# EAGLE design Adafruit 2.13in Tri-Color eInk Display (EAGLE 6.6.0)
COMPANY: ADAFRUIT INDUSTRIES; DRAWN: K. TOWNSEND; REV: A
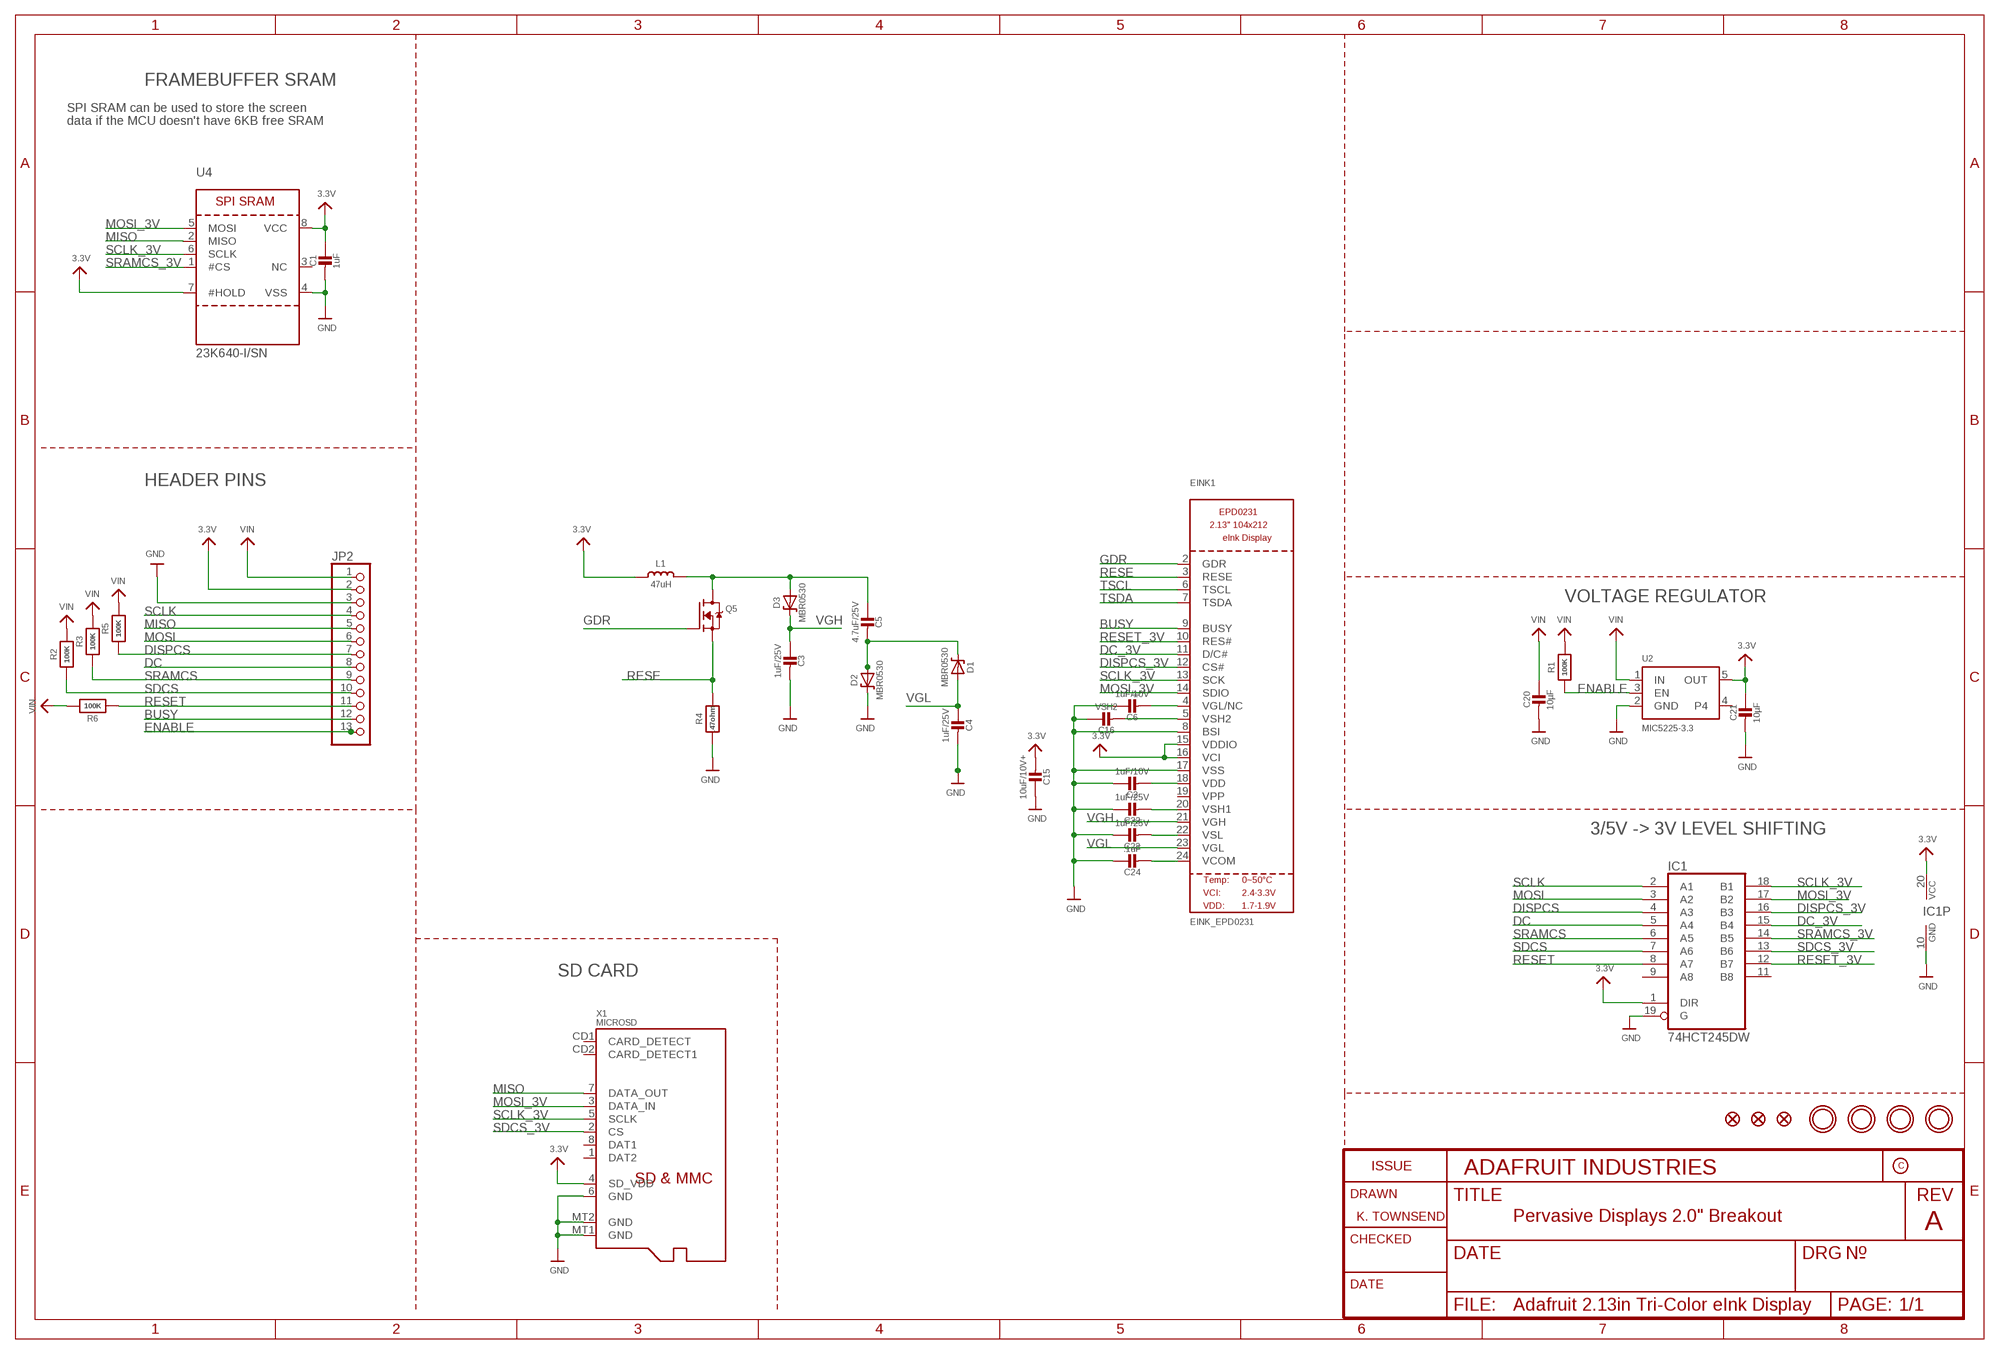
[diagram p0: schematic, sheet 1]

## Parts
C1  1uF  CAP_CERAMIC0805_10MGAP  [0805_10MGAP]
C2  1uF/10V  CAP_CERAMIC0805-NOOUTLINE  [0805-NO]
C3  1uF/25V  CAP_CERAMIC0805-NOOUTLINE  [0805-NO]
C4  1uF/25V  CAP_CERAMIC0805-NOOUTLINE  [0805-NO]
C5  4.7uF/25V  CAP_CERAMIC0805-NOOUTLINE  [0805-NO]
C6  1uF/10V  CAP_CERAMIC0805-NOOUTLINE  [0805-NO]
C15  10uF/10V+  CAP_CERAMIC0805-NOOUTLINE  [0805-NO]
C16  VSH2  CAP_CERAMIC0805-NOOUTLINE  [0805-NO]
C20  10µF  CAP_CERAMIC0805-NOOUTLINE  [0805-NO]
C21  10µF  CAP_CERAMIC0805-NOOUTLINE  [0805-NO]
C22  1uF/25V  CAP_CERAMIC0805-NOOUTLINE  [0805-NO]
C23  1uF/25V  CAP_CERAMIC0805-NOOUTLINE  [0805-NO]
C24  .1uF  CAP_CERAMIC0805-NOOUTLINE  [0805-NO]
D1  MBR0530  DIODE-SCHOTTKYSOD-123  [SOD-123]
D2  MBR0530  DIODE-SCHOTTKYSOD-123  [SOD-123]
D3  MBR0530  DIODE-SCHOTTKYSOD-123  [SOD-123]
EINK1  EINK_EPD0231  [EINK_213IN_104X212]
FID1  FIDUCIAL_1MM  [FIDUCIAL_1MM]
FID2  FIDUCIAL_1MM  [FIDUCIAL_1MM]
FID3  FIDUCIAL_1MM  [FIDUCIAL_1MM]
IC1  74HCT245DW  [SO20W]
JP2  HEADER-1X13  [1X13_ROUND_70]
L1  47uH  INDUCTORNR401  [INDUCTOR_4X4MM_NR401]
Q5  IRLML0100  IRLML2060TRPBF  [SOT23-3]
R1  100K  RESISTOR0805_NOOUTLINE  [0805-NO]
R2  100K  RESISTOR0805_NOOUTLINE  [0805-NO]
R3  100K  RESISTOR0805_NOOUTLINE  [0805-NO]
R4  .47ohm  RESISTOR0805_10MGAP  [0805_10MGAP]
R5  100K  RESISTOR0805_NOOUTLINE  [0805-NO]
R6  100K  RESISTOR0805_NOOUTLINE  [0805-NO]
U2  MIC5225-3.3  VREG_SOT23-5  [SOT23-5]
U4  23K640-I/SN  SRAM_SPI_SOIC8  [SOIC8_150MIL]
U$3  MOUNTINGHOLE2.5  [MOUNTINGHOLE_2.5_PLATED]
U$4  MOUNTINGHOLE2.5  [MOUNTINGHOLE_2.5_PLATED]
U$5  MOUNTINGHOLE2.5  [MOUNTINGHOLE_2.5_PLATED]
U$6  MOUNTINGHOLE2.5  [MOUNTINGHOLE_2.5_PLATED]
X1  MICROSD  [MICROSD]

## Nets
3.3V: C1.1 C15.2 C21.1 EINK1.15(VDDIO) EINK1.16(VCI) IC1.1(DIR) IC1.20(VCC) JP2.2 L1.P$2 U2.5(OUT) U4.7(#HOLD) U4.8(VCC) X1.4(SD_VDD)
BUSY: EINK1.9(BUSY) JP2.12
DC: IC1.5(A4) JP2.8
DC_3V: EINK1.11(D/C#) IC1.15(B4)
DISPCS: IC1.4(A3) JP2.7 R5.1
DISPCS_3V: EINK1.12(CS#) IC1.16(B3)
ENABLE: JP2.13 R1.1 U2.3(EN)
GDR: EINK1.2(GDR) Q5.1(G)
GND: C1.2 C2.1 C3.2 C4.2 C6.1 C15.1 C16.1 C20.2 C21.2 C22.1 C23.1 C24.1 D2.C EINK1.8(BSI) EINK1.17(VSS) IC1.10(GND) IC1.19(G) JP2.3 R4.2 U2.2(GND) U4.4(VSS) X1.6(GND) X1.MT1(GND) X1.MT2(GND)
MISO: JP2.5 U4.2(MISO) X1.7(DATA_OUT)
MOSI: IC1.3(A2) JP2.6
MOSI_3V: EINK1.14(SDIO) IC1.17(B2) U4.5(MOSI) X1.3(DATA_IN)
N$2: C5.2 D1.C D2.A
N$3: C5.1 D3.A L1.P$1 Q5.3(D)
N$4: C16.2 EINK1.5(VSH2)
N$5: C2.2 EINK1.18(VDD)
N$6: C22.2 EINK1.20(VSH1)
N$9: C6.2 EINK1.4(VGL/NC)
N$27: C23.2 EINK1.22(VSL)
N$33: C24.2 EINK1.24(VCOM)
RESE: EINK1.3(RESE) Q5.2(S) R4.1
RESET: IC1.8(A7) JP2.11 R6.1
RESET_3V: EINK1.10(RES#) IC1.12(B7)
SCLK: IC1.2(A1) JP2.4
SCLK_3V: EINK1.13(SCK) IC1.18(B1) U4.6(SCLK) X1.5(SCLK)
SDCS: IC1.7(A6) JP2.10 R2.1
SDCS_3V: IC1.13(B6) X1.2(CS)
SRAMCS: IC1.6(A5) JP2.9 R3.1
SRAMCS_3V: IC1.14(B5) U4.1(#CS)
TSCL: EINK1.6(TSCL)
TSDA: EINK1.7(TSDA)
VGH: C3.1 D3.C EINK1.21(VGH)
VGL: C4.1 D1.A EINK1.23(VGL)
VIN: C20.1 JP2.1 R1.2 R2.2 R3.2 R5.2 R6.2 U2.1(IN)
Unconnected: EINK1.19(VPP) IC1.9(A8) IC1.11(B8) U2.4 U4.3(NC) X1.1(DAT2) X1.8(DAT1) X1.CD1(CARD_DETECT) X1.CD2(CARD_DETECT1)

## Notes on the sheet
- FRAMEBUFFER SRAM
- SPI SRAM can be used to store the screen
- data if the MCU doesn't have 6KB free SRAM
- HEADER PINS
- VOLTAGE REGULATOR
- 3/5V -> 3V LEVEL SHIFTING
- SD CARD
- Pervasive Displays 2.0" Breakout

## Library data of the parts
C1-C6 C15 C16 C20-C24 = microbuilder:CAP_CERAMIC: Ceramic Capacitors For new designs, use the packages preceded by an '_' character since they are more reliable: The following footprints should be used on most boards: _0402 - Standard footprint for regular board layouts _0603 - Standard footprint for regular board layouts _0805 - Standard footprint for regular board layouts _1206 - Standard footprint for regular board layouts For extremely tight-pitch boards where space is at a premium, the following 'micro-pitch' footprints can be used (smaller pads, no silkscreen outline, etc.): _0402MP - Micro-pitch footprint for very dense/compact boards _0603MP - Micro-pitch footprint for very dense/compact boards _0805MP - Micro-pitch footprint for very dense/compact boards _1206MP - Micro-pitch footprint for very dense/compact boards
D1-D3 = microbuilder:DIODE-SCHOTTKY
EINK1 = microbuilder:EINK_EPD0231
FID1-FID3 = microbuilder:FIDUCIAL: Fiducial Alignment Points Various fiducial points for machine vision alignment.; BOM: EXCLUDE
IC1 = 74xx-eu:74*245: Octal BUS TRANSCEIVER, 3-state
JP2 = microbuilder:HEADER-1X13
L1 = microbuilder:INDUCTOR: Inductors 0603: 10nH Ceramic Inductor - microwire antenna/RF (Digikey: 712-1434-2-ND) 0805: 560nH Ceramic Inductor - RF (Digikey: 553-1047-1-ND) 270nH Ceramic Inductor - Q = 40@250MHz, +-5%, 1 Ohm DC Resistance (Digikey: 535-10506-2-ND) 1007 (2518 Metric) SMT: 10µH 10% 250mOhm 820mA 1007 Inductor (Digikey: 587-2189-1-ND) 22µH 10% 500mOhm 580mA 1007 Inductor (Digikey: 587-2190-1-ND) 47µH 10% 950mOhm 420mA 1007 Inductor (Digikey: 587-2191-1-ND) 47µH 5% 100mOhm 1A 1008 Inductor (Digikey: 732-1816-1-ND) 5.0x5.0mm (Taiyo Yuden NR5040 Series) 6.8µH 20% 2.3A 64mOhm Inductor (Digikey: 587-2374-2-ND) 5.0x5.0mm (TDK VLC5045 Series) 4.7µH 20% 3.3A 34mOhm Inductor (Digikey: 445-6526-1-ND) 6.8µH 20% 2.7A 46mOhm Inductor (Digikey: 445-6527-1-ND) 6.0x6.0mm (TDK VLC6045 Series) 4.7µH 20% 3.8A 27mOhm Inductor (Digikey: 445-6538-2-ND) 6.8µH 20% 3A 41mOhm Inductor (Digikey: 445-6540-1-ND) 6.2µH 30% 2.2A 45mOhm Inductor (Digikey: SRR5028-6R2YCT-ND) - Not TDK VLC6045 but footprint should match 6.0x6.0mm (TDK SLF6045 Series) 6.8uH 30% 2A 33mOhm Inductor (Digikey: 445-4572-1-ND, Mouser: 810-SLF645T6R8N2R0PF) 6.0x6.0mm (Sumida CDRH5D28 Series) 6.2uH 30% 1.8A 45mOhm Inductor (Digikey: 308-1542-1-ND) Taiyo Yuden NR3015T2R2M - 2.2uH 20% 1.5A (Digikey: 587-1648-2-ND, Mouser: 963-NR3015T2R2M) - Used with TI TPS62172 CoilCraft RFID Transponder Coil - MA5532-AE (For use with AS3935 Lightning Sensor) Taiyo Yuden NRH2412T2R2MNGH - 2.2uH 20% 1AA (Digikey: 587-3443-1-ND) - Used with TI LM3671 Vishay IHLP 1.0uH Molded Inductor - 24mOhm DCR, 5A, +/-20%, -55°C-125°C (Digikey: 541-1319-1-ND)
Q5 = Parts:IRLML2060TRPBF
R1-R6 = microbuilder:RESISTOR: Resistors For new designs, use the packages preceded by an '_' character since they are more reliable: The following footprints should be used on most boards: _0402 - Standard footprint for regular board layouts _0603 - Standard footprint for regular board layouts _0805 - Standard footprint for regular board layouts _1206 - Standard footprint for regular board layouts For extremely tight-pitch boards where space is at a premium, the following 'micro-pitch' footprints can be used (smaller pads, no silkscreen outline, etc.): _0402MP - Micro-pitch footprint for very dense/compact boards _0603MP - Micro-pitch footprint for very dense/compact boards _0805MP - Micro-pitch footprint for very dense/compact boards _1206MP - Micro-pitch footprint for very dense/compact boards
U2 = microbuilder:VREG_SOT23-5: SOT23-5 Fixed Voltage Regulators Part Current Out V Out V In V Dropout θJA (°C/W) TJ (°C) Digikey Part No. ADP121 150mA 3.3V 3.4-5.5V 0.09V @ 150mA -- -- ADP121-AUJZ33R7CT-ND ADP121 150mA 3.0V 3.1-5.5V 0.09V @ 150mA -- -- ADP121-AUJZ30R7CT-ND ADP122 300mA 3.3V 3.4-5.5V 0.085V @ 300mA -- -- ADP122AUJZ-3.3-R7CT-ND ADP1712 300mA 3.3V 3.5-5.5V 0.17V @ 300mA -- -- ADP1712AUJZ-3.3-R7TR-ND AP7311 (Low Cost) 150mA 3.3V 3.5-6V 0.15V @ 150mA -- -- AP7311-33WG-7DICT-ND LD39015M18R 150mA 1.8V 1.9V-5.5V 0.08V @ 100mA -- -- 497-6977-1-ND LP2985A-33DBVR 150mA 3.3V 3.3-16V 0.28V @ 150mA 206 150 296-18479-1-ND MCP1824T-3302E/OT 300mA 3.3V 3.5V-6V 0.2V @ 300mA -- -- MCP1824T-3302E/OTCT-ND MIC5205-2.5YM5 TR 150mA 2.5V 2.7-16V 0.165V @ 150mA -- -- 576-1257-2-ND MIC5205-3.0YM5 TR 150mA 3.0V 3.2V-16V 0.165V @ 150mA -- -- 576-1258-2-ND MIC5205-3.3YM5 TR 150mA 3.3V 3.5V-16V 0.165V @ 150mA -- -- 576-1259-2-ND TPS780330220 150mA 3.3V+2.2V 3.6-5.5V 250mV Max -- -- 296-23332-1-ND TDA3663/N1,135 100mA 3.3V 3.5-45V 0.18V @ 50mA -- -- 568-5343-1-ND Max operating temp can be calculated using θJA, TJ (max junction temperature), and power in watts. Set the "Maximum Ambient Temperature" until it reaches TJ ("Max Junction Temperature"), which is the absolute limit for safe use of the regulator: Heat Sink Temperature Calculator <http://www.daycounter.com/Calculators/Heat-Sink-Temperature-Calculator.phtml> For example, With 12V source into a 3.3V LP2985 and a 30mA load, we are dissipating (12V-3.3V) * 0.03A = 0.261W. With a θJA of 206 °C/W, a TJ of 150°C, and 261mW we can safely use the chip without a heat sink up to 75°C (=147.1°C Junction Temperature).
U4 = microbuilder:SRAM_SPI_SOIC8: SRAM - 8-Pin SPI Interface 23K640-I/SN - 8KB (64Kb), 20MHz, 2.7-3.6V 23K256-I/SN - 32KB (256Kb), 20MHz, 2.7-3.6V 23LC512-I/SN - 64KB (512Kb), 20MHz, 2.7-3.6V
U$3-U$6 = microbuilder:MOUNTINGHOLE: Mounting Hole For #2 screws (0.086"/2.18mm width, 0.094"/2.4mm hole) use 2.5mm; BOM: EXCLUDE
X1 = microbuilder:MICROSD: MicroSD/Transflash Card Holder with SPI pinout 3M: 2908-05WB-MG 4UConnector: 19656 Footprint courtesy: Adafruit Industries

## Board
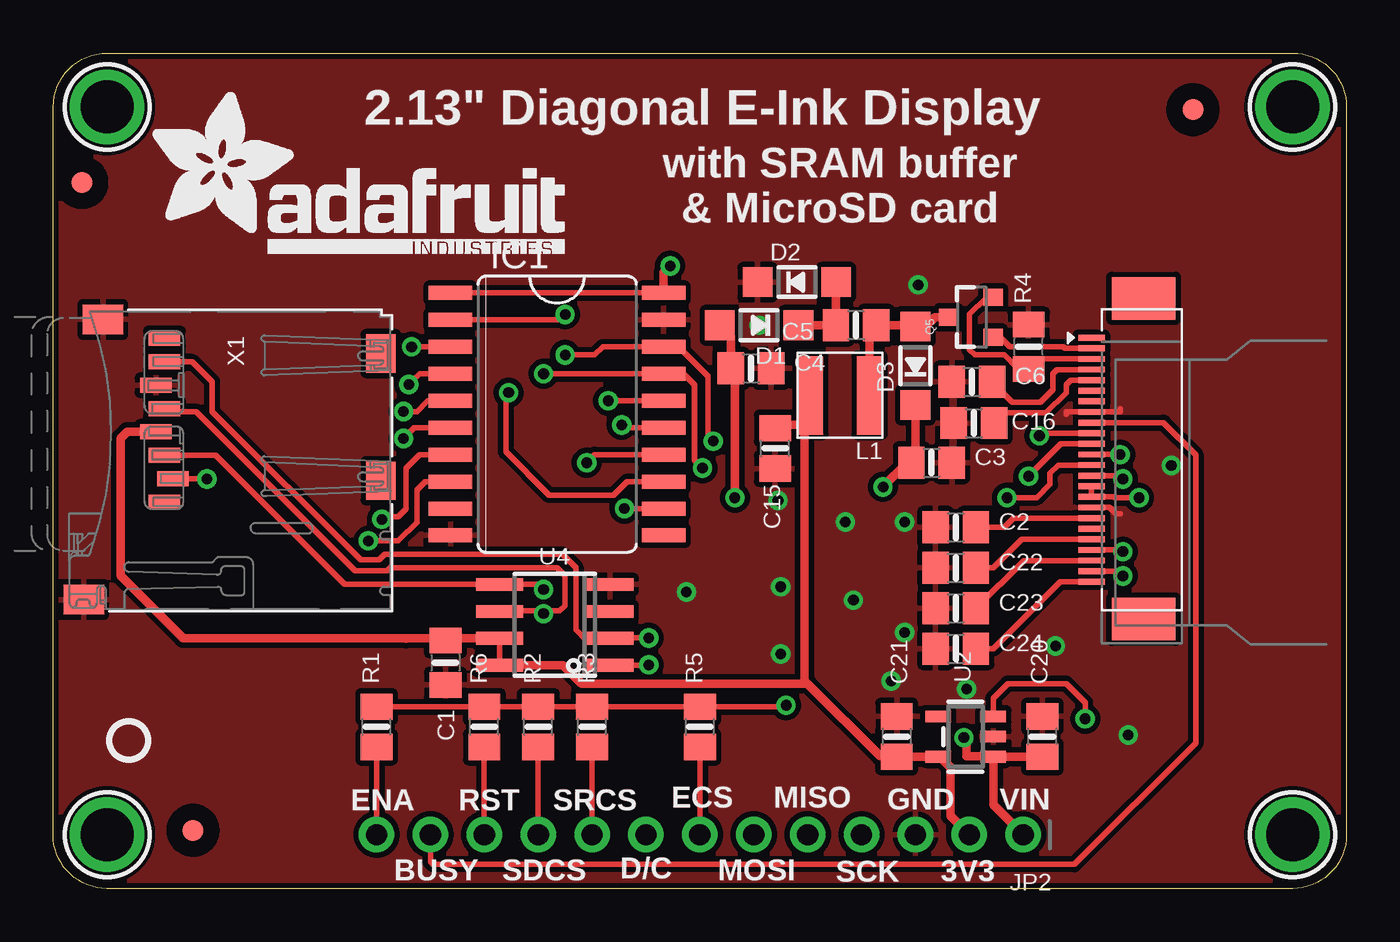
[diagram p1: board, top side]
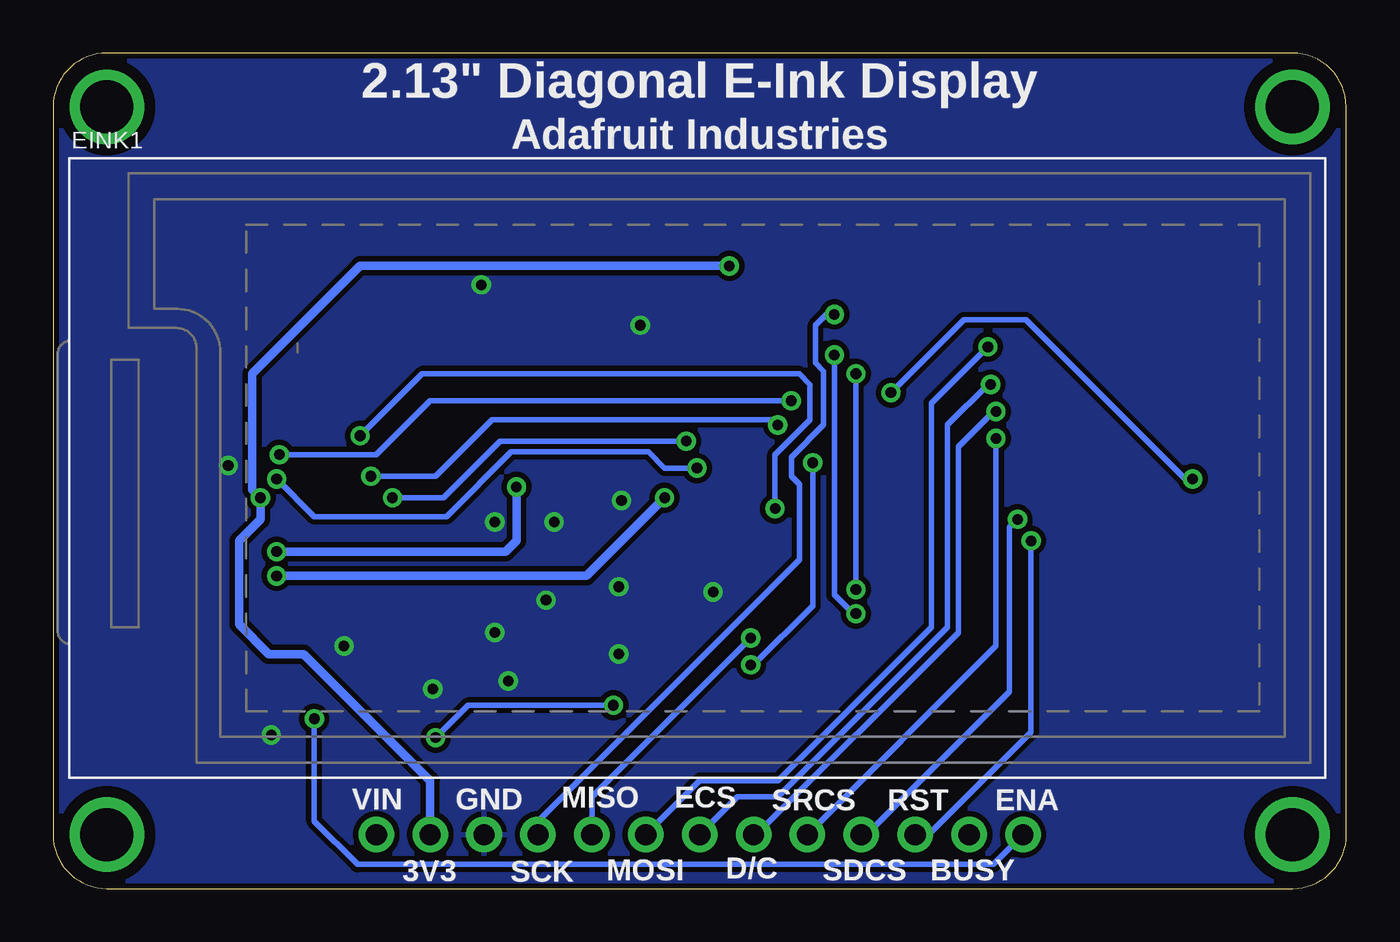
[diagram p2: board, bottom side, seen from below]

Size 60.97 x 39.37 mm. Coordinates in mm from the lower left corner, seen from the top.
Outline: 58.43,0 2.54,0 arc-90 0,2.54 0.01,36.83 arc-90 2.55,39.37 58.43,39.37 arc-90 60.97,36.83 60.97,2.54 arc-90 58.43,0
Copper layers (1*16): Top 0.035mm / dielectric 1.5mm / Bottom 0.035mm
Design rules "adafruit *": minimum track width 8mil, minimum drill 15.5mil, track to track 8mil, track to pad 8mil, pad to pad 8mil, via to via 8mil, smd to smd 8mil, copper to edge 10mil, drill to drill 8mil, minimum pad ring 10mil, minimum via ring 8mil, stop-mask expansion 2mil, vias tented up to drill 20mil, thermal gap 10mil

### Footprints (pad centres in the part's own frame; a part is rotated, then mirrored left to right if it is on the bottom)
0805_10MGAP = smd 1.2 x 1.5: 1 -1.05,0; 2 1.05,0
0805-NO = smd 1.24 x 1.5: 1 -0.95,0; 2 0.95,0
SOD-123 = smd 1.4 x 1.4: A 1.85,0; C -1.85,0
EINK_213IN_104X212 = smd 1.25 x 0.275 bottom: 1 11.26,-8.46; 2 11.26,-8.96; 3 11.26,-9.46; 4 11.26,-9.96; 5 11.26,-10.46; 6 11.26,-10.96; 7 11.26,-11.46; 8 11.26,-11.96; 9 11.26,-12.46; 10 11.26,-12.96; 11 11.26,-13.46; 12 11.26,-13.96; 13 11.26,-14.46; 14 11.26,-14.96; 15 11.26,-15.46; 16 11.26,-15.96; 17 11.26,-16.46; 18 11.26,-16.96; 19 11.26,-17.46; 20 11.26,-17.96; 21 11.26,-18.46; 22 11.26,-18.96; 23 11.26,-19.46; 24 11.26,-19.96 | smd 3 x 2 bottom: SPRT1 8.8,-6.61; SPRT2 8.8,-21.72
FIDUCIAL_1MM = smd 1 x 1: 1 0,0
SO20W = smd 0.66 x 2.032: 1 -5.715,-5.029; 2 -4.445,-5.029; 3 -3.175,-5.029; 4 -1.905,-5.029; 5 -0.635,-5.029; 6 0.635,-5.029; 7 1.905,-5.029; 8 3.175,-5.029; 9 4.445,-5.029; 10 5.715,-5.029; 11 5.715,5.029; 12 4.445,5.029; 13 3.175,5.029; 14 1.905,5.029; 15 0.635,5.029; 16 -0.635,5.029; 17 -1.905,5.029; 18 -3.175,5.029; 19 -4.445,5.029; 20 -5.715,5.029
1X13_ROUND_70 = drill 1 pad 1.676: 1 -15.24,0; 2 -12.7,0; 3 -10.16,0; 4 -7.62,0; 5 -5.08,0; 6 -2.54,0; 7 0,0; 8 2.54,0; 9 5.08,0; 10 7.62,0; 11 10.16,0; 12 12.7,0; 13 15.24,0
INDUCTOR_4X4MM_NR401 = smd 1.2 x 3.7: P$1 -1.4,0; P$2 1.4,0
SOT23-3 = smd 0.8 x 0.9: 1 -0.95,-1; 2 0.95,-1; 3 0,1.1
SOT23-5 = smd 0.55 x 1.2: 1 -0.95,-1.3; 2 0,-1.3; 3 0.95,-1.3; 4 0.95,1.3; 5 -0.95,1.3
SOIC8_150MIL = smd 0.6 x 2.2: 1 -1.905,-2.6; 2 -0.635,-2.6; 3 0.635,-2.6; 4 1.905,-2.6; 5 1.905,2.6; 6 0.635,2.6; 7 -0.635,2.6; 8 -1.905,2.6
MOUNTINGHOLE_2.5_PLATED = drill 2.5 pad 3.2: P$1 0,0
MICROSD = smd 0.7 x 1.5: 1 9,-10.64; 2 7.9,-10.24; 3 6.8,-10.64; 4 5.7,-11.04; 5 4.6,-10.64; 6 3.5,-11.04; 7 2.4,-10.64; 8 1.3,-10.64 | smd 1.8 x 1.4: CD1 2,-0.44; CD2 8,-0.44 | smd 1.4 x 1.9: MT1 0.4,-13.54; MT2 13.6,-14.44

### Placement (x,y rotation side)
C1  18.5,10.65 270 top
C2  42.56,17.02 0 top
C3  41.41,20.07 0 top
C4  32.9,24.51 0 top
C5  37.86,26.54 180 top
C6  43.32,23.88 0 top
C15  34.04,20.74 90 top
C16  43.41,21.93 0 top
C20  46.64,7.16 90 top
C21  39.77,7.16 90 top
C22  42.56,15.11 0 top
C23  42.56,13.21 0 top
C24  42.56,11.3 0 top
D1  33.28,26.54 180 top
D2  35.06,28.57 0 top
D3  40.65,24.64 90 top
EINK1  60.21,34.42 0 bottom
FID1  1.36,33.27 0 top
FID2  6.6,2.75 90 top
FID3  53.73,36.7 0 top
IC1  23.76,22.35 270 top
JP2  30.49,2.54 180 top
L1  37.09,23.24 180 top
Q5  43.32,26.92 90 top
R1  15.25,7.62 90 top
R2  22.87,7.62 90 top
R3  25.41,7.62 90 top
R4  45.98,25.53 90 top
R5  30.49,7.62 90 top
R6  20.33,7.62 90 top
U2  43.02,7.16 90 top
U4  23.65,12.43 90 top
U$3  58.43,2.54 0 top
U$4  2.55,2.54 0 top
U$5  58.43,36.83 0 top
U$6  2.55,36.83 0 top
U$9  [PCBFEAT-REV-040]  3.57,6.99 0 top
U$28  [ADAFRUIT_TEXT_20MM]  4.54,29.91 0 top
X1  15.89,27.22 270 top

### Tracks (layer width: path | path; a pad name or v marks a point on that pad's centre or on a via)
3.3V  (via drill 0.5)
  Top 0.254: U4.7 U4.8 | IC1.1 IC1.20 | EINK1.15 EINK1.16 50.01,18.46 50.05,18.41 v51.19,18.41
  Top 0.406: X1.4 3.49,21.52 3.19,21.21 3.19,14.73 6.13,11.79 16.65,11.79 | 16.65,11.77 16.65,11.79 | L1.P$2 35.41,22.96 35.41,21.84 | 35.57,9.65 39,6.22 39.77,6.22 C21.1 U2.5 41.8,6.21 42.3,5.71 42.3,3.43 JP2.2 | IC1.20 28.79,29.03 v29.09,29.34 | U4.8 24.03,10.52 24.9,9.65 35.57,9.65 | 16.65,11.79 18.5,11.79 | U4.7 18.5,11.79 | 18.5,11.79 C1.1 | 35.57,9.65 35.41,9.81 35.41,21.84 | C15.2 34.2,21.84 35.41,21.84
  Bottom 0.406: v29.09,29.34 46.49,29.34 51.57,24.26 51.57,18.8 v51.19,18.41 51.19,17.4 52.21,16.38 52.21,12.45 50.81,11.05 49.16,11.05 43.19,5.08 JP2.2
BUSY
  Top 0.254: JP2.12 17.79,1.27 17.92,1.14 48.14,1.14 53.86,6.86 53.86,20.45 52.35,21.96 EINK1.9
DC  (via drill 0.5)
  Top 0.254: IC1.5 17.66,22.99 17.16,22.48 v16.52,22.48
  Bottom 0.254: v16.52,22.48 16.65,22.48 18.3,20.83 18.3,12.06 27.82,2.54 JP2.8
DC_3V  (via drill 0.5)
  Top 0.254: IC1.15 26.93,21.72 v26.81,21.84 | EINK1.11 47.51,20.96 v45.98,19.43
  Bottom 0.254: v26.81,21.84 27.06,22.1 40.27,22.1 42.94,19.43 v45.98,19.43
DISPCS  (via drill 0.5)
  Top 0.254: IC1.4 17.28,24.26 v16.77,23.75 | R5.1 JP2.7
  Bottom 0.254: v16.77,23.75 16.9,23.75 18.81,21.84 18.81,12.32 26.81,4.32 28.71,4.32 JP2.7
DISPCS_3V  (via drill 0.5)
  Top 0.254: IC1.16 v26.17,22.99 | EINK1.12 v50.29,20.46 v50.3,20.45
  Bottom 0.254: v26.17,22.99 43.19,22.99 45.73,20.45 45.86,20.45 46.75,20.45 v50.3,20.45
ENABLE  (via drill 0.5)
  Top 0.254: U2.3 44.32,8.97 45,9.65 47.76,9.65 48.65,8.76 v48.65,8 | R1.1 JP2.13
  Bottom 0.254: JP2.13 16.65,1.14 46.62,1.14 48.65,3.17 v48.65,8
GDR
  Top 0.254: Q5.1 44.65,25.97 45.1,25.53 47.64,25.53 47.71,25.46 EINK1.2
GND  (via drill 0.5)
  Top 0.254: 50.3,22.61 50.3,22.46 EINK1.8 47.76,22.46 47.76,22.35 | EINK1.17 49.79,17.96 50.1,17.65 50.3,17.65
  other vias: 34.17,18.29 33.28,26.54 40.78,28.45 40.14,17.27 34.3,11.05 34.3,14.22 29.86,13.97 43.06,9.4 37.35,17.27 40.14,12.06 39.51,9.78 47.25,11.43 50.68,7.24 52.72,19.94 37.73,13.59
  pour Top (isolate 0.254): 0.01,39.37 60.97,39.37 60.97,0 0.01,0
  pour Bottom (isolate 0.254): 0.01,39.37 60.97,39.37 60.97,0 0.01,0
MISO  (via drill 0.5)
  Top 0.254: 5.31,24.77 X1.7 6.56,24.82 7.5,23.88 7.5,22.48 14.49,15.49 15.38,15.49 15.63,15.75 24.01,15.75 24.65,15.11 24.65,12.19 25.16,11.68 26.15,11.68 U4.2 26.36,11.68 26.49,11.81 v28.08,11.81
  Bottom 0.254: v28.08,11.81 35.57,4.32 JP2.5
MOSI  (via drill 0.5)
  Top 0.254: IC1.3 v16.9,25.53
  Bottom 0.254: v16.9,25.53 19.57,22.86 19.57,12.32 26.81,5.08 30.49,5.08 JP2.6
MOSI_3V  (via drill 0.5)
  Top 0.254: X1.3 7.66,20.42 13.75,14.33 U4.5 22.89,14.33 v23.12,14.1 | v23.12,24.26 IC1.17 29.73,24.26 30.24,23.75 30.24,20.19 v30.62,19.81 | EINK1.14 50.28,19.46 v50.43,19.3
  Bottom 0.254: v23.12,14.1 v23.12,24.26 | v30.62,19.81 32.14,19.81 32.9,20.57 39.38,20.57 42.43,17.53 48.65,17.53 v50.43,19.3
N$2
  Top 0.406: D2.A C5.2 D1.C
N$3
  Top 0.406: L1.P$1 38.49,26.23 C5.1 40.6,26.54 D3.A 41.13,26.49 41.57,26.92 Q5.3
N$4
  Top 0.254: C16.2 44.84,22.42 46.81,22.42 47.76,23.37 47.76,23.75 47.97,23.96 EINK1.5
N$5
  Top 0.254: C2.2 44.84,17.02 45.28,17.46 EINK1.18
N$6
  Top 0.254: C22.2 44.33,15.11 45.68,16.46 EINK1.20
N$9
  Top 0.254: C6.2 45.23,22.92 46.55,22.92 47.13,23.5 47.13,24.26 47.33,24.46 EINK1.4
N$27
  Top 0.254: C23.2 45.75,15.46 EINK1.22
N$33
  Top 0.254: C24.2 44.33,11.3 47.49,14.46 EINK1.24
RESE
  Top 0.254: Q5.2 44.01,27.87 43.19,27.05 43.19,25.4 43.44,25.15 44.84,25.15 45.51,24.48 R4.1 46.46,24.96 EINK1.3
RESET  (via drill 0.5)
  Top 0.254: IC1.8 17.54,19.18 17.16,18.8 17.16,17.27 16.27,16.38 v14.87,16.38 | R6.1 JP2.11
  Bottom 0.254: v14.87,16.38 14.87,7.37 19.7,2.54 JP2.11
RESET_3V  (via drill 0.5)
  Top 0.254: IC1.12 v26.93,17.91 | EINK1.10 46.61,21.46 v46.49,21.34
  Bottom 0.254: v26.93,17.91 26.93,20.45 25.28,22.1 25.28,23.75 25.79,24.26 43.57,24.26 v46.49,21.34
SCLK  (via drill 0.5)
  Top 0.254: IC1.2 23.89,26.8 v24.14,27.05
  Bottom 0.254: JP2.4 38.11,3.17 25.79,15.49 25.79,19.05 26.17,19.43 26.17,20.32 24.65,21.84 24.65,24.38 25.03,24.77 25.03,26.54 24.52,27.05 v24.14,27.05
SCLK_3V  (via drill 0.5)
  Top 0.254: X1.5 5.39,22.48 6.74,22.48 14.23,14.99 15.76,14.99 15.89,15.11 23.76,15.11 24.14,14.73 24.14,13.34 23.89,13.08 23.12,13.08 | 23.12,13.08 21.07,13.08 U4.6 | 23.12,13.08 v23.12,12.95 | v24.14,25.15 25.54,25.15 25.92,25.53 IC1.18 29.47,25.53 30.87,24.13 30.87,21.34 v31.13,21.08 | v44.97,18.41 v44.97,18.42 46.37,18.42 47,19.05 47,19.56 47.4,19.96 EINK1.13
  Bottom 0.254: v24.14,25.15 24.14,13.84 23.25,12.95 v23.12,12.95 | v31.13,21.08 39.89,21.08 42.56,18.41 v44.97,18.41
SDCS  (via drill 0.5)
  Top 0.254: IC1.7 17.28,20.45 16.65,19.81 16.65,17.91 16.27,17.53 15.63,17.53 v15.5,17.4 | R2.1 JP2.10
  Bottom 0.254: v15.5,17.4 15.89,17.02 15.89,9.27 22.62,2.54 JP2.10
SDCS_3V  (via drill 0.5)
  Top 0.254: IC1.13 27.06,19.18 26.43,18.54 23.38,18.54 21.35,20.57 21.35,23.24 v21.47,23.37 | v7.25,19.3 7.24,19.32 X1.2
  Bottom 0.254: v21.47,23.37 18.04,26.8 15.12,26.8 7.63,19.3 v7.25,19.3
SRAMCS  (via drill 0.5)
  Top 0.254: IC1.6 17.03,21.72 v16.52,21.21 | R3.1 JP2.9
  Bottom 0.254: v16.52,21.21 16.52,11.43 JP2.9
SRAMCS_3V  (via drill 0.5)
  Top 0.254: U4.1 28.06,10.52 v28.08,10.54 | v25.16,20.07 25.54,20.45 IC1.14
  Bottom 0.254: v25.16,20.07 25.16,13.34 27.95,10.54 v28.08,10.54
VGH  (via drill 0.5)
  Top 0.254: EINK1.21 50.35,15.96 v50.43,15.88
  Top 0.406: D3.C 40.65,20.13 40.59,20.07 C3.1 40.27,20.07 v39.13,18.92
  Bottom 0.406: v50.43,15.88 39.63,15.88 39.13,16.38 v39.13,18.92
VGL  (via drill 0.5)
  Top 0.254: D1.A 31.45,26.53 | EINK1.23 50.2,14.96 v50.43,14.73
  Top 0.406: 32.2,18.36 v32.14,18.41 32.14,24.32 C4.1 31.95,26.02 31.45,26.53
  Bottom 0.406: v50.43,14.73 35.82,14.73 v32.14,18.41
VIN  (via drill 0.5)
  Top 0.254: v42.94,7.11 43.06,7.11 | R1.2 R6.2 R2.2 R3.2 R5.2 34.49,8.57 v34.55,8.64
  Top 0.406: JP2.1 44.32,3.95 U2.1 | v42.94,7.11 43.06,6.99 43.06,6.22 44.31,6.22 U2.1 | C20.1 U2.1
  Bottom 0.254: v34.55,8.64 41.41,8.64 v42.94,7.11

### Text on the board
tPlace: 2.13" Diagonal E-Ink Display | with SRAM buffer / & MicroSD card | ENA | RST | SRCS | ECS | MISO | GND | VIN | BUSY | SDCS | D/C | MOSI | SCK | 3V3
bPlace: 2.13" Diagonal E-Ink Display | Adafruit Industries | ENA | RST | SRCS | ECS | MISO | GND | VIN | BUSY | SDCS | D/C | MOSI | SCK | 3V3